# Altium schematic sheet MasterLight.SchDoc
size A4
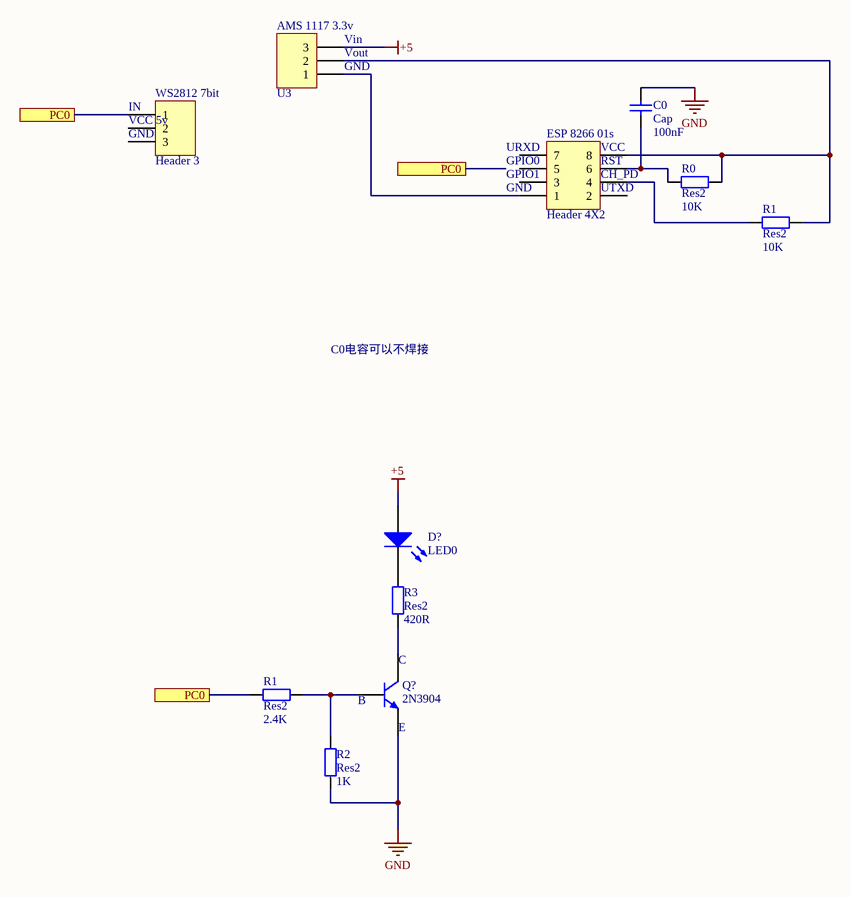
[diagram p0: MasterLight.SchDoc]

## Parts
(Parts that share a designator on the sheet are numbered #1, #2 ... from top to bottom, then left to right.)
AMS_1117_3.3v  U3  [HDR1X3]
C0  Cap  value 100nF  [RAD-0.3]
D?  LED0  [LED-0]
ESP_8266_01s  Header 4X2  [HDR2X4]
Q?  2N3904  [TO-92A]
R0  Res2  value 10K  [AXIAL-0.4]
R1#1  Res2  value 10K  [AXIAL-0.4]
R1#2  Res2  value 2.4K  [AXIAL-0.4]
R2  Res2  value 1K  [AXIAL-0.4]
R3  Res2  value 420R  [AXIAL-0.4]
WS2812_7bit  Header 3  [HDR1X3]

## Ports
PC0

## Nets
+5: AMS_1117_3.3v.3 D?.1(A)
GND: C0.2 Q?.1(E) R2.2
PC0: R1#2.1 WS2812_7bit.1 ; port PC0
NetAMS_1117_3.3v_1: AMS_1117_3.3v.1 ESP_8266_01s.1
NetAMS_1117_3.3v_2: AMS_1117_3.3v.2 ESP_8266_01s.8 R0.1 R1#1.1
NetC0_1: C0.1 ESP_8266_01s.6 R0.2
NetD?_2: D?.2(K) R3.2
NetESP_8266_01s_4: ESP_8266_01s.4 R1#1.2
NetQ?_2: Q?.2(B) R1#2.2 R2.1
NetQ?_3: Q?.3(C) R3.1

Not connected (* = marked no-connect by the designer): ESP_8266_01s 2 3 5 7; WS2812_7bit 2 3

## Notes on the sheet
- (near AMS_1117_3.3v) GND
- (near AMS_1117_3.3v) Vout
- (near AMS_1117_3.3v) Vin
- (near WS2812_7bit) GND
- (near WS2812_7bit) VCC 5v
- (near WS2812_7bit) IN
- (near ESP_8266_01s) GPIO0
- (near ESP_8266_01s) URXD
- (near ESP_8266_01s) RST
- (near ESP_8266_01s) VCC
- (near ESP_8266_01s) GND
- (near ESP_8266_01s) GPIO1
- (near ESP_8266_01s) UTXD
- (near ESP_8266_01s) CH_PD
- C0电容可以不焊接
- (near Q?) B
- (near Q?) C
- (near Q?) E

## Library data of the parts
AMS_1117_3.3v WS2812_7bit = Header 3: Header, 3-Pin; LatestRevisionDate: 17-Jul-2002; LatestRevisionNote: Re-released for DXP Platform.; Publisher: Altium Limited
C0 = Cap: Capacitor; Published: 8-Jun-2000; LatestRevisionDate: 17-Jul-2002; LatestRevisionNote: Re-released for DXP Platform.; PackageReference: RAD-0.3; Publisher: Altium Limited; PackageDescription: Radial Cap, Thru-Hole; 2 Leads; 0.3 in Pin Spacing
D? = LED0: Typical INFRARED GaAs LED; Published: 8-Jun-2000; LatestRevisionDate: 08-Jul-2005; LatestRevisionNote: Mech Layer 1 removed.; PackageReference: LED-0; Publisher: Altium Limited; PackageDescription: LED; 2 Leads
ESP_8266_01s = Header 4X2: Header, 4-Pin, Dual row; LatestRevisionDate: 17-Jul-2002; LatestRevisionNote: Re-released for DXP Platform.; Publisher: Altium Limited
Q? = 2N3904: NPN General Purpose Amplifier; Published: 8-Jun-2000; LatestRevisionDate: 15-Jan-2003; LatestRevisionNote: PCB Footprint 'BCY-W3/D4.7' replaced; DatasheetVersion: 1997; PackageVersion: Sep-1998; PackageReference: TO-92A; Publisher: Altium Limited; PackageDescription: TO, Flat Index; 3 In-Line, Axial Leads; Body Dia. 4.5mm; Leads 0.51 x 0.48 mm (max); ComponentLink1Description: Manufacturer Link; ComponentLink1URL: http://www.fairchildsemi.com/; ComponentLink2Description: Datasheet; ComponentLink2URL: http://www.fairchildsemi.com/ds/2N%2F2N3904.pdf
R0 R1#1 R1#2 R2 R3 = Res2: Resistor; Published: 8-Jun-2000; LatestRevisionDate: 17-Jul-2002; LatestRevisionNote: Re-released for DXP Platform.; PackageReference: AXIAL-0.4; Publisher: Altium Limited; PackageDescription: Axial Device, Thru-Hole; 2 Leads; 0.4 in Pin Spacing